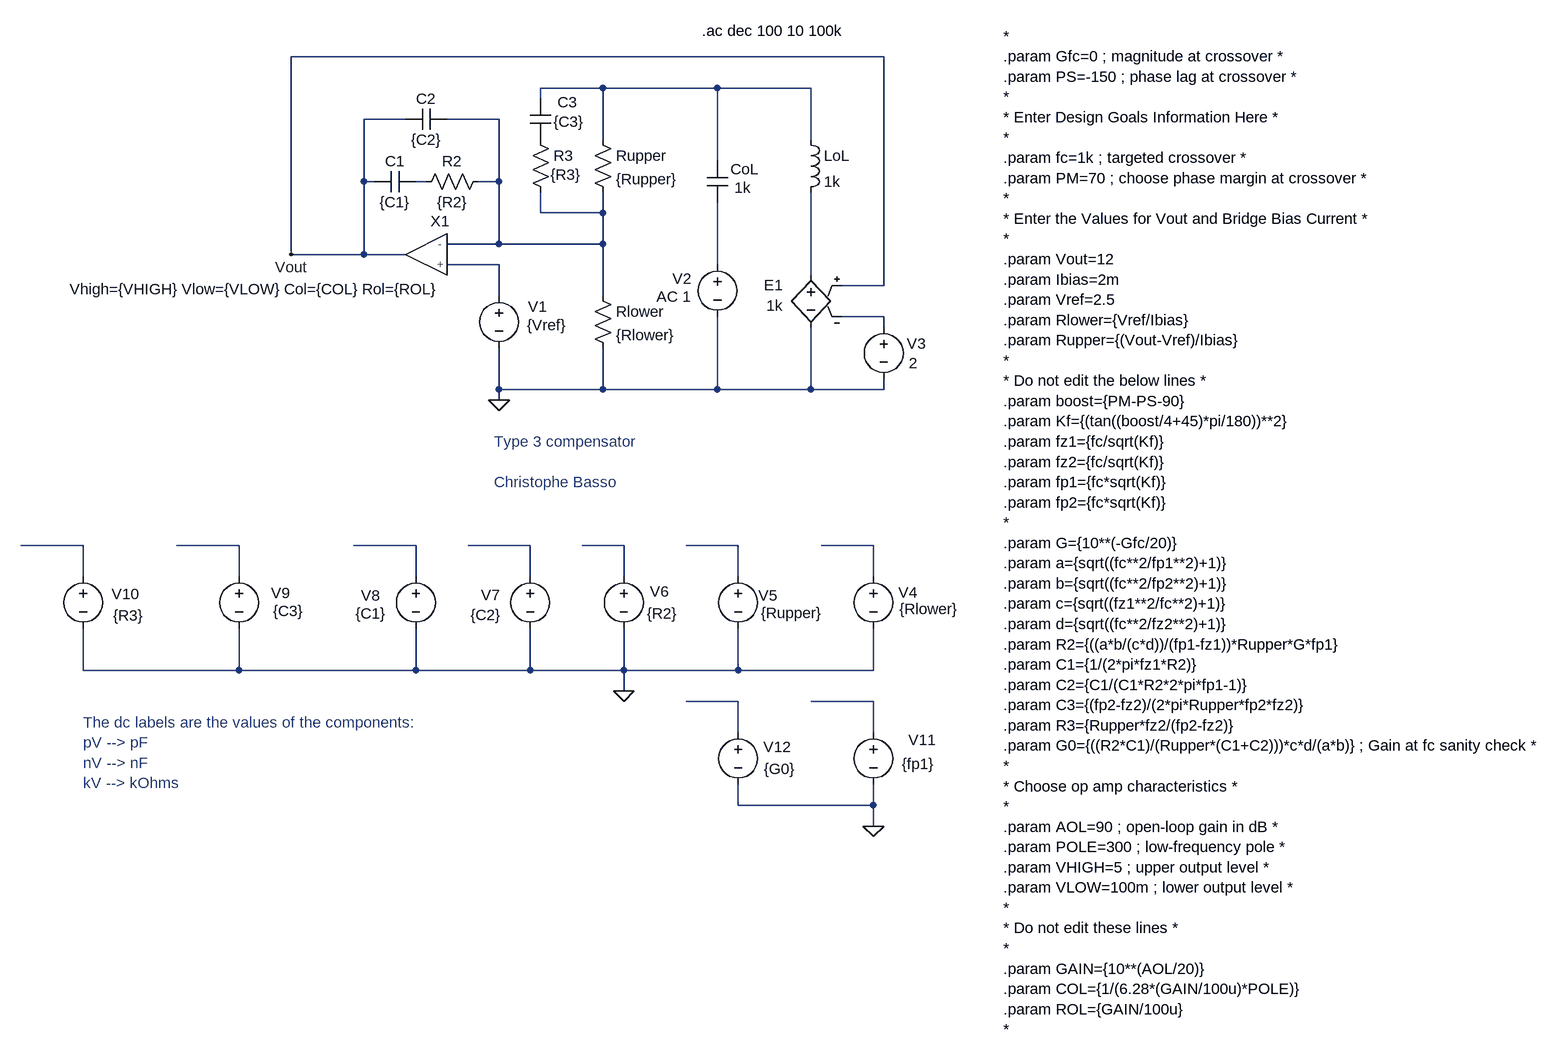
[diagram p0: schematic type 3 - op amp - k factor.asc]
type 3 - op amp - k factor.asc, the LTspice schematic file:
Version 4.1
SHEET 1 2296 1340
WIRE 832 -128 -80 -128
WIRE 400 -80 304 -80
WIRE 576 -80 400 -80
WIRE 720 -80 576 -80
WIRE 304 -64 304 -80
WIRE 96 -32 32 -32
WIRE 240 -32 160 -32
WIRE 400 0 400 -80
WIRE 720 0 720 -80
WIRE 576 32 576 -80
WIRE 32 64 32 -32
WIRE 48 64 32 64
WIRE 128 64 112 64
WIRE 240 64 240 -32
WIRE 240 64 208 64
WIRE 304 112 304 80
WIRE 400 112 400 80
WIRE 400 112 304 112
WIRE 240 160 240 64
WIRE 240 160 160 160
WIRE 400 160 400 112
WIRE 400 160 240 160
WIRE -80 176 -80 -128
WIRE 32 176 32 64
WIRE 32 176 -80 176
WIRE 96 176 32 176
WIRE 240 192 160 192
WIRE 576 192 576 96
WIRE 720 208 720 80
WIRE 832 224 832 -128
WIRE 832 224 768 224
WIRE 240 240 240 192
WIRE 400 240 400 160
WIRE 832 272 768 272
WIRE 832 288 832 272
WIRE 240 384 240 320
WIRE 400 384 400 320
WIRE 400 384 240 384
WIRE 576 384 576 272
WIRE 576 384 400 384
WIRE 720 384 720 288
WIRE 720 384 576 384
WIRE 832 384 832 368
WIRE 832 384 720 384
WIRE 240 400 240 384
WIRE -400 624 -496 624
WIRE -160 624 -256 624
WIRE 112 624 16 624
WIRE 288 624 192 624
WIRE 432 624 368 624
WIRE 608 624 528 624
WIRE 816 624 736 624
WIRE -400 672 -400 624
WIRE -160 672 -160 624
WIRE 112 672 112 624
WIRE 288 672 288 624
WIRE 432 672 432 624
WIRE 608 672 608 624
WIRE 816 672 816 624
WIRE -400 816 -400 752
WIRE -160 816 -160 752
WIRE -160 816 -400 816
WIRE 112 816 112 752
WIRE 112 816 -160 816
WIRE 288 816 288 752
WIRE 288 816 112 816
WIRE 432 816 432 752
WIRE 432 816 288 816
WIRE 608 816 608 752
WIRE 608 816 432 816
WIRE 816 816 816 752
WIRE 816 816 608 816
WIRE 432 848 432 816
WIRE 608 864 528 864
WIRE 816 864 720 864
WIRE 608 912 608 864
WIRE 816 912 816 864
WIRE 608 1024 608 992
WIRE 816 1024 816 992
WIRE 816 1024 608 1024
WIRE 816 1056 816 1024
FLAG 240 400 0
FLAG -80 176 Vout
FLAG 432 848 0
FLAG 816 1056 0
DATAFLAG 640 -80 ""
DATAFLAG 112 -128 ""
DATAFLAG 304 160 ""
DATAFLAG 32 624 ""
DATAFLAG 224 624 ""
DATAFLAG 400 624 ""
DATAFLAG 544 624 ""
DATAFLAG 768 624 ""
DATAFLAG -464 624 ""
DATAFLAG -224 624 ""
DATAFLAG 736 864 ""
DATAFLAG 576 864 ""
SYMBOL opampTOF 96 160 M0
WINDOW 0 -53 -20 Bottom 2
WINDOW 39 230 85 Bottom 2
SYMATTR InstName X1
SYMATTR SpiceLine Vhigh={VHIGH} Vlow={VLOW} Col={COL} Rol={ROL}
SYMBOL res 384 224 R0
SYMATTR InstName Rlower
SYMATTR Value {Rlower}
SYMBOL res 384 -16 R0
SYMATTR InstName Rupper
SYMATTR Value {Rupper}
SYMBOL voltage 240 224 R0
WINDOW 0 45 32 Left 2
WINDOW 3 43 61 Left 2
WINDOW 123 0 0 Left 0
WINDOW 39 0 0 Left 0
SYMATTR InstName V1
SYMATTR Value {Vref}
SYMBOL cap 112 48 R90
WINDOW 0 0 32 VBottom 2
WINDOW 3 32 32 VTop 2
SYMATTR InstName C1
SYMATTR Value {C1}
SYMBOL cap 560 32 R0
WINDOW 0 36 13 Left 2
WINDOW 3 42 41 Left 2
SYMATTR InstName CoL
SYMATTR Value 1k
SYMBOL voltage 576 176 M0
WINDOW 0 40 37 Left 2
WINDOW 123 40 65 Left 2
WINDOW 39 0 0 Left 0
SYMATTR InstName V2
SYMATTR Value2 AC 1
SYMATTR Value ""
SYMBOL ind 704 -16 R0
SYMATTR InstName LoL
SYMATTR Value 1k
SYMBOL e 720 192 M0
WINDOW 0 43 31 Left 2
WINDOW 3 43 63 Left 2
SYMATTR InstName E1
SYMATTR Value 1k
SYMBOL voltage 832 272 R0
WINDOW 0 36 41 Left 2
WINDOW 3 39 71 Left 2
SYMATTR InstName V3
SYMATTR Value 2
SYMBOL res 224 48 R90
WINDOW 0 0 56 VBottom 2
WINDOW 3 32 56 VTop 2
SYMATTR InstName R2
SYMATTR Value {R2}
SYMBOL cap 160 -48 R90
WINDOW 0 0 32 VBottom 2
WINDOW 3 32 32 VTop 2
SYMATTR InstName C2
SYMATTR Value {C2}
SYMBOL voltage 816 656 R0
WINDOW 0 39 40 Left 2
WINDOW 3 40 66 Left 2
WINDOW 123 0 0 Left 0
WINDOW 39 0 0 Left 0
SYMATTR InstName V4
SYMATTR Value {Rlower}
SYMBOL voltage 608 656 R0
WINDOW 0 31 45 Left 2
WINDOW 3 35 72 Left 2
WINDOW 123 0 0 Left 0
WINDOW 39 0 0 Left 0
SYMATTR InstName V5
SYMATTR Value {Rupper}
SYMBOL voltage 432 656 R0
WINDOW 0 40 39 Left 2
WINDOW 3 36 73 Left 2
WINDOW 123 0 0 Left 0
WINDOW 39 0 0 Left 0
SYMATTR InstName V6
SYMATTR Value {R2}
SYMBOL voltage 288 656 R0
WINDOW 0 -76 44 Left 2
WINDOW 3 -92 75 Left 2
SYMATTR InstName V7
SYMATTR Value {C2}
SYMBOL voltage 112 656 R0
WINDOW 0 -84 45 Left 2
WINDOW 3 -93 73 Left 2
WINDOW 123 0 0 Left 0
WINDOW 39 0 0 Left 0
SYMATTR InstName V8
SYMATTR Value {C1}
SYMBOL cap 288 -64 R0
WINDOW 0 42 6 Left 2
WINDOW 3 36 36 Left 2
SYMATTR InstName C3
SYMATTR Value {C3}
SYMBOL res 288 -16 R0
WINDOW 3 31 69 Left 2
SYMATTR Value {R3}
SYMATTR InstName R3
SYMBOL voltage -160 656 R0
WINDOW 0 49 41 Left 2
WINDOW 3 52 69 Left 2
SYMATTR InstName V9
SYMATTR Value {C3}
SYMBOL voltage -400 656 R0
WINDOW 0 44 43 Left 2
WINDOW 3 46 76 Left 2
SYMATTR InstName V10
SYMATTR Value {R3}
SYMBOL voltage 816 896 R0
WINDOW 0 54 27 Left 2
WINDOW 3 44 64 Left 2
WINDOW 123 0 0 Left 0
WINDOW 39 0 0 Left 0
SYMATTR InstName V11
SYMATTR Value {fp1}
SYMBOL voltage 608 896 R0
WINDOW 0 39 38 Left 2
WINDOW 3 40 72 Left 2
SYMATTR InstName V12
SYMATTR Value {G0}
TEXT 1016 -160 Left 2 !*\n.param Gfc=0 ; magnitude at crossover *\n.param PS=-150 ; phase lag at crossover *\n*\n* Enter Design Goals Information Here *\n*\n.param fc=1k ; targeted crossover *\n.param PM=70 ; choose phase margin at crossover *\n*\n* Enter the Values for Vout and Bridge Bias Current *\n*\n.param Vout=12\n.param Ibias=2m\n.param Vref=2.5\n.param Rlower={Vref/Ibias}\n.param Rupper={(Vout-Vref)/Ibias}\n*\n* Do not edit the below lines *\n.param boost={PM-PS-90}\n.param Kf={(tan((boost/4+45)*pi/180))**2}\n.param fz1={fc/sqrt(Kf)}\n.param fz2={fc/sqrt(Kf)}\n.param fp1={fc*sqrt(Kf)}\n.param fp2={fc*sqrt(Kf)}\n*\n.param G={10**(-Gfc/20)}\n.param a={sqrt((fc**2/fp1**2)+1)}\n.param b={sqrt((fc**2/fp2**2)+1)}\n.param c={sqrt((fz1**2/fc**2)+1)}\n.param d={sqrt((fc**2/fz2**2)+1)}\n.param R2={((a*b/(c*d))/(fp1-fz1))*Rupper*G*fp1}\n.param C1={1/(2*pi*fz1*R2)}\n.param C2={C1/(C1*R2*2*pi*fp1-1)}\n.param C3={(fp2-fz2)/(2*pi*Rupper*fp2*fz2)}\n.param R3={Rupper*fz2/(fp2-fz2)}\n.param G0={((R2*C1)/(Rupper*(C1+C2)))*c*d/(a*b)} ; Gain at fc sanity check *\n*\n* Choose op amp characteristics *\n*\n.param AOL=90 ; open-loop gain in dB *\n.param POLE=300 ; low-frequency pole *\n.param VHIGH=5 ; upper output level *\n.param VLOW=100m ; lower output level *\n*\n* Do not edit these lines *\n*\n.param GAIN={10**(AOL/20)}\n.param COL={1/(6.28*(GAIN/100u)*POLE)}\n.param ROL={GAIN/100u}\n*
TEXT 552 -168 Left 2 !.ac dec 100 10 100k
TEXT 232 464 Left 2 ;Type 3 compensator\n \nChristophe Basso
TEXT -400 896 Left 2 ;The dc labels are the values of the components:\npV --> pF\nnV --> nF\nkV --> kOhms

The netlist it stands for:
* type 3 - op amp - k factor.asc
X§X1 N002 N004 Vout opampTOF params: Vhigh={VHIGH} Vlow={VLOW} Col={COL} Rol={ROL}  ; pins - + OUT
Rlower N002 0 {Rlower}
Rupper N001 N002 {Rupper}
V1 N004 0 {Vref}
C1 N003 Vout {C1}
CoL N001 N005 1k
V2 N005 0 AC 1
LoL N001 N006 1k
E1 N006 0 Vout N007 1k
V3 N007 0 2
R2 N002 N003 {R2}
C2 N002 Vout {C2}
V4 N014 0 {Rlower}
V5 N013 0 {Rupper}
V6 N012 0 {R2}
V7 N011 0 {C2}
V8 N010 0 {C1}
C3 N001 P001 {C3}
R3 P001 N002 {R3}
V9 N009 0 {C3}
V10 N008 0 {R3}
V11 N016 0 {fp1}
V12 N015 0 {G0}
*
.param Gfc=0 ; magnitude at crossover *
.param PS=-150 ; phase lag at crossover *
*
* Enter Design Goals Information Here *
*
.param fc=1k ; targeted crossover *
.param PM=70 ; choose phase margin at crossover *
*
* Enter the Values for Vout and Bridge Bias Current *
*
.param Vout=12
.param Ibias=2m
.param Vref=2.5
.param Rlower={Vref/Ibias}
.param Rupper={(Vout-Vref)/Ibias}
*
* Do not edit the below lines *
.param boost={PM-PS-90}
.param Kf={(tan((boost/4+45)*pi/180))**2}
.param fz1={fc/sqrt(Kf)}
.param fz2={fc/sqrt(Kf)}
.param fp1={fc*sqrt(Kf)}
.param fp2={fc*sqrt(Kf)}
*
.param G={10**(-Gfc/20)}
.param a={sqrt((fc**2/fp1**2)+1)}
.param b={sqrt((fc**2/fp2**2)+1)}
.param c={sqrt((fz1**2/fc**2)+1)}
.param d={sqrt((fc**2/fz2**2)+1)}
.param R2={((a*b/(c*d))/(fp1-fz1))*Rupper*G*fp1}
.param C1={1/(2*pi*fz1*R2)}
.param C2={C1/(C1*R2*2*pi*fp1-1)}
.param C3={(fp2-fz2)/(2*pi*Rupper*fp2*fz2)}
.param R3={Rupper*fz2/(fp2-fz2)}
.param G0={((R2*C1)/(Rupper*(C1+C2)))*c*d/(a*b)} ; Gain at fc sanity check *
*
* Choose op amp characteristics *
*
.param AOL=90 ; open-loop gain in dB *
.param POLE=300 ; low-frequency pole *
.param VHIGH=5 ; upper output level *
.param VLOW=100m ; lower output level *
*
* Do not edit these lines *
*
.param GAIN={10**(AOL/20)}
.param COL={1/(6.28*(GAIN/100u)*POLE)}
.param ROL={GAIN/100u}
*
.ac dec 100 10 100k
* Type 3 compensator
* Christophe Basso
* The dc labels are the values of the components:
* pV --> pF
* nV --> nF
* kV --> kOhms
.backanno
.end